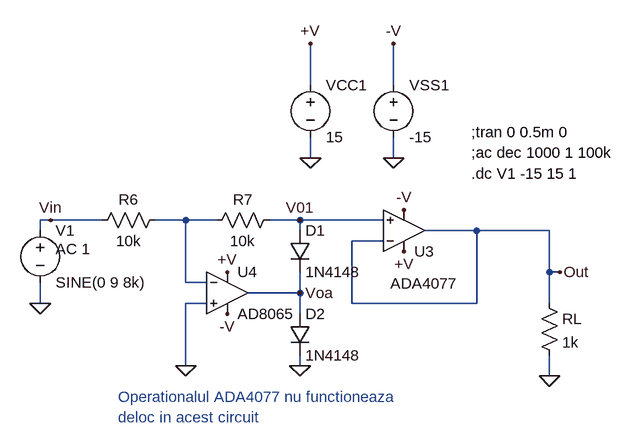
[diagram p0: schematic ET4_DCsweep.asc]
ET4_DCsweep.asc, the LTspice schematic file:
Version 4
SHEET 1 956 680
WIRE 112 -1056 112 -1120
WIRE 240 -1056 240 -1120
WIRE 112 -944 112 -976
WIRE 240 -944 240 -976
WIRE -288 -848 -304 -848
WIRE -208 -848 -288 -848
WIRE -80 -848 -128 -848
WIRE -32 -848 -80 -848
WIRE 96 -848 48 -848
WIRE 224 -848 96 -848
WIRE -304 -832 -304 -848
WIRE 96 -832 96 -848
WIRE 368 -832 288 -832
WIRE 480 -832 368 -832
WIRE 224 -816 176 -816
WIRE 480 -768 480 -832
WIRE 496 -768 480 -768
WIRE -80 -752 -80 -848
WIRE -48 -752 -80 -752
WIRE 96 -736 96 -768
WIRE 96 -736 16 -736
WIRE -304 -720 -304 -752
WIRE -48 -720 -80 -720
WIRE 176 -720 176 -816
WIRE 368 -720 368 -832
WIRE 368 -720 176 -720
WIRE 480 -720 480 -768
WIRE 96 -704 96 -736
WIRE -80 -624 -80 -720
WIRE 96 -624 96 -640
WIRE 480 -608 480 -640
FLAG -304 -720 0
FLAG 496 -768 Out
FLAG 480 -608 0
FLAG -288 -848 Vin
FLAG -16 -768 +V
FLAG 256 -800 +V
FLAG -16 -704 -V
FLAG 256 -864 -V
FLAG -80 -624 0
FLAG 96 -624 0
FLAG 112 -944 0
FLAG 240 -944 0
FLAG 112 -1120 +V
FLAG 240 -1120 -V
FLAG 96 -736 Voa
FLAG 96 -848 V01
SYMBOL voltage -304 -848 R0
WINDOW 123 24 44 Left 2
WINDOW 39 0 0 Left 2
SYMATTR Value2 AC 1
SYMATTR InstName V1
SYMATTR Value SINE(0 9 8k)
SYMBOL res 464 -736 R0
SYMATTR InstName RL
SYMATTR Value 1k
SYMBOL OpAmps\\ADA4077 256 -768 M180
WINDOW 3 -21 -17 Left 2
SYMATTR InstName U3
SYMBOL res -112 -864 R90
WINDOW 0 0 56 VBottom 2
WINDOW 3 32 56 VTop 2
SYMATTR InstName R6
SYMATTR Value 10k
SYMBOL res 64 -864 R90
WINDOW 0 0 56 VBottom 2
WINDOW 3 32 56 VTop 2
SYMATTR InstName R7
SYMATTR Value 10k
SYMBOL voltage 112 -1072 R0
WINDOW 123 0 0 Left 2
WINDOW 39 0 0 Left 2
SYMATTR InstName VCC1
SYMATTR Value 15
SYMBOL voltage 240 -1072 R0
WINDOW 123 0 0 Left 2
WINDOW 39 0 0 Left 2
SYMATTR InstName VSS1
SYMATTR Value -15
SYMBOL diode 80 -832 R0
SYMATTR InstName D1
SYMATTR Value 1N4148
SYMBOL diode 80 -704 R0
SYMATTR InstName D2
SYMATTR Value 1N4148
SYMBOL OpAmps\\AD8065 -16 -800 R0
SYMATTR InstName U4
TEXT 360 -984 Left 2 !;tran 0 0.5m 0
TEXT 360 -920 Left 2 !.dc V1 -15 15 1
TEXT 360 -952 Left 2 !;ac dec 1000 1 100k
TEXT -184 -576 Left 2 ;Operationalul ADA4077 nu functioneaza \ndeloc in acest circuit

The netlist it stands for:
* ET4_DCsweep.asc
V1 Vin 0 SINE(0 9 8k) AC 1
RL Out 0 1k
XU3 V01 Out +V -V Out ADA4077  ; pins In+ In- V+ V- OUT
R6 N001 Vin 10k
R7 V01 N001 10k
VCC1 +V 0 15
VSS1 -V 0 -15
D1 V01 Voa 1N4148
D2 Voa 0 1N4148
XU4 0 N001 +V -V Voa AD8065  ; pins In+ In- V+ V- OUT
.model D D
.lib standard.dio
;tran 0 0.5m 0
.dc V1 -15 15 1
;ac dec 1000 1 100k
* Operationalul ADA4077 nu functioneaza
* deloc in acest circuit
.backanno
.end